# EasyEDA Pro project ProPrj_遥控_2025-12-06.epro, schematic NRF无线模块
Board Name: NRF无线模块; Create Date: 2025-10-11; Page Name: Sheet_1 copy; Project Name: 遥控; Schematic Name: NRF无线模块; Update Date: 2025-10-11; Add into BOM: yes; Company: Your Company; Convert to PCB: yes; Date: 2024-07-08; Draw By: akatople; REV: 1.0; Sheet: 1/1; spicePre: .
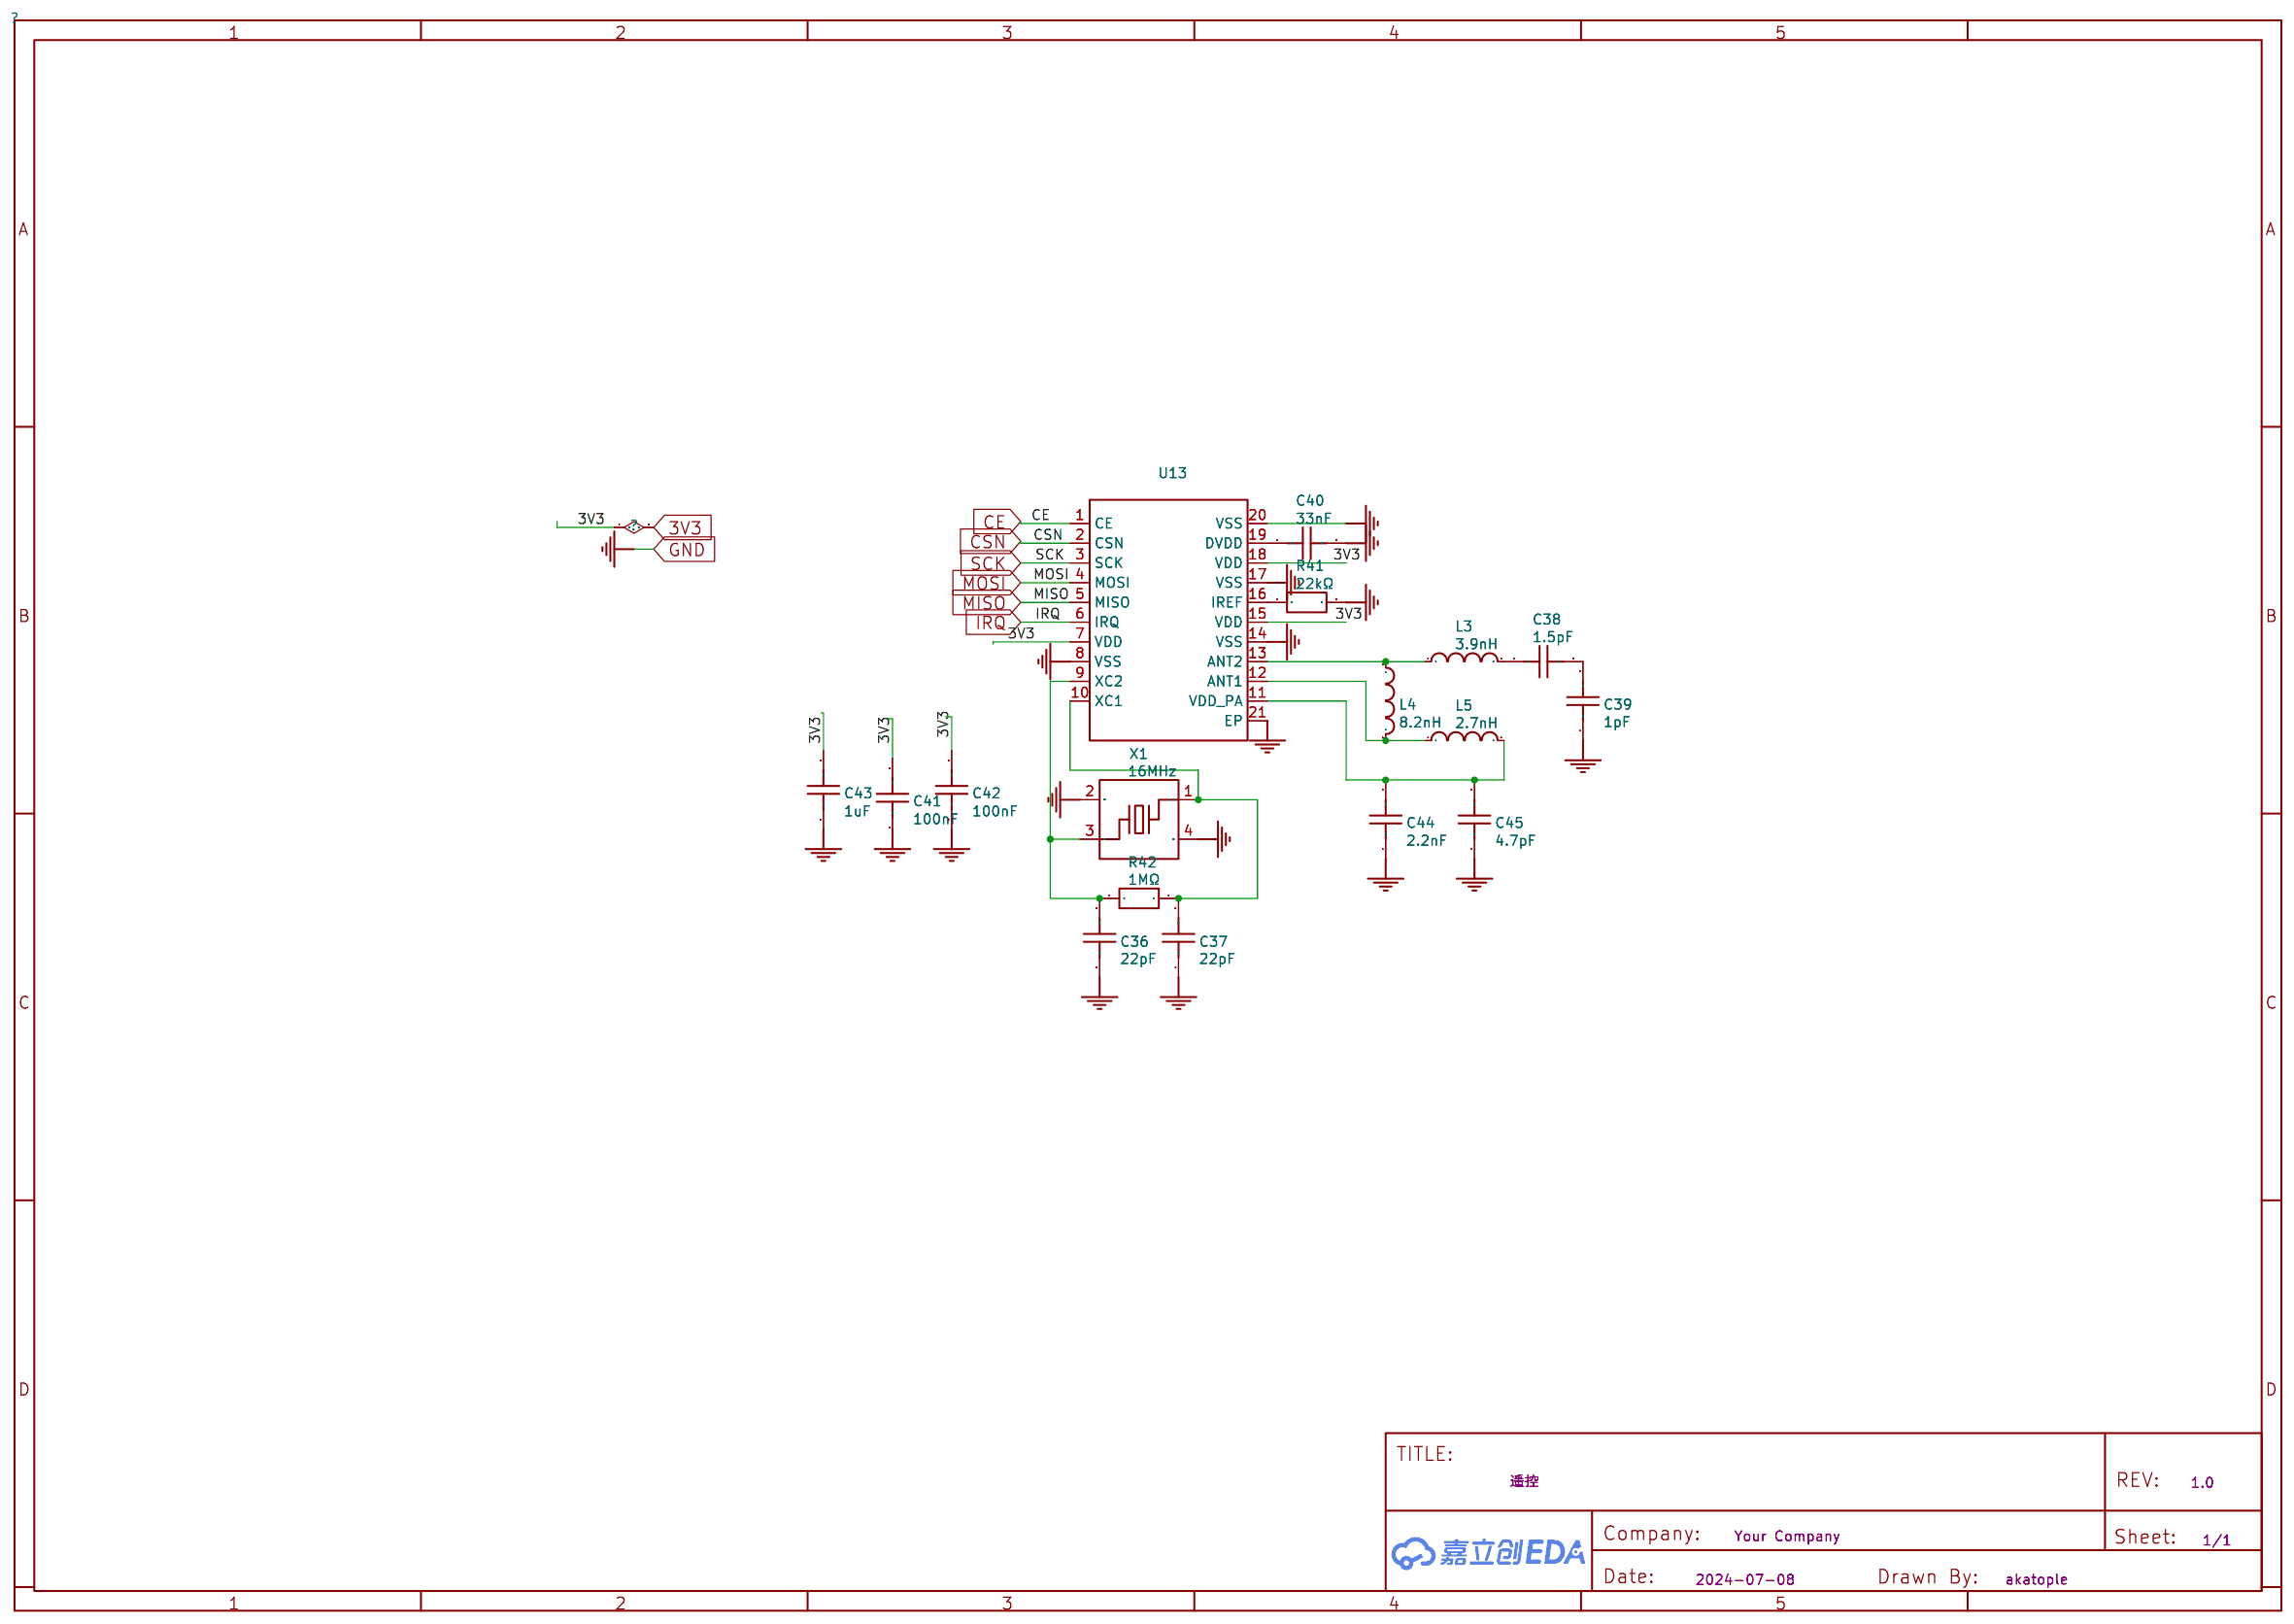
[diagram p3: schematic sheet]

## Parts
C36  22pF  [C0603]
C37  22pF  [C0603]
C38  1.5pF  [C0603]
C39  1pF  [C0603]
C40  33nF  [C0603]
C41  100nF  [C0603]
C42  100nF  [C0603]
C43  1uF  [C0603]
C44  2.2nF  [C0603]
C45  4.7pF  [C0603]
L3  3.9nH  [L0603]
L4  8.2nH  [L0603]
L5  2.7nH  [L0603]
R41  22kΩ  [R0603]
R42  1MΩ  [R0603]
U13  NRF24L01P-R  [QFN-20_L4.0-W4.0-P0.50-BL-EP]
X1  16MHz  [CRYSTAL-SMD_4P-L2.0-W1.6-BL]

## Library data of the parts
C36 C37 = CL10C220JB8NNNC: 容值:22pF;精度:±5%;额定电压:50V;温度系数:C0G;; LCSC Part Name: 22pF ±5% 50V; Supplier Part: C1653; Manufacturer: SAMSUNG(三星); Supplier Footprint: 0603; JLCPCB Part Class: Basic Part; Datasheet: https://item.szlcsc.com/datasheet/CL10C220JB8NNNC/2005.html; Supplier: LCSC; Tolerance: ±5%; Voltage Rating: 50V; Temperature Coefficient: C0G
C38 = 0603CG1R5C500NT: 容值:1.5pF;额定电压:50V;温度系数:C0G;; LCSC Part Name: ±0.25pF 1.5pF 50V; Supplier Part: C1639; Manufacturer: FH(风华); Supplier Footprint: 0603; JLCPCB Part Class: Extended Part; Datasheet: https://atta.szlcsc.com/upload/public/pdf/source/20200305/C486355_26A10D38EF8C2A5C37091D0039909270.pdf; Supplier: LCSC; Voltage Rating: 50V; Temperature Coefficient: C0G
C39 = 0603CG1R0C500NT: 容值:1pF;额定电压:50V;材质(温度系数):C0G;; LCSC Part Name: 1pF 50V; Supplier Part: C37117; Manufacturer: FH(风华); Supplier Footprint: 0603; JLCPCB Part Class: Extended Part; Datasheet: https://atta.szlcsc.com/upload/public/pdf/source/20200305/C486355_26A10D38EF8C2A5C37091D0039909270.pdf; Supplier: LCSC; Voltage Rated: 50V; Temperature Coefficient: C0G
C40 = CL10B333KB8NNNC: 容值:33nF;精度:±10%;额定电压:50V;温度系数:X7R;; LCSC Part Name: 33nF ±10% 50V; Supplier Part: C21117; Manufacturer: SAMSUNG(三星); Supplier Footprint: 0603; JLCPCB Part Class: Basic Part; Datasheet: https://item.szlcsc.com/datasheet/CL10B333KB8NNNC/21829.html; Supplier: LCSC; Tolerance: ±10%; Voltage Rating: 50V; Temperature Coefficient: X7R
C41 C42 = CC0603KRX7R9BB104: 容值:100nF;精度:±10%;额定电压:50V;温度系数:X7R;; LCSC Part Name: 100nF ±10% 50V; Supplier Part: C14663; Manufacturer: YAGEO(国巨); Supplier Footprint: 0603; JLCPCB Part Class: Basic Part; Datasheet: https://atta.szlcsc.com/upload/public/pdf/source/20250214/096C4C206003071F5D32E5F0D8E7F8DF.pdf; Supplier: LCSC; Tolerance: ±10%; Voltage Rating: 50V; Temperature Coefficient: X7R
C43 = CL10A105KB8NNNC: 容值:1uF;精度:±10%;额定电压:50V;温度系数:X5R;; LCSC Part Name: 1uF ±10% 50V; Supplier Part: C15849; Manufacturer: SAMSUNG(三星); Supplier Footprint: 0603; JLCPCB Part Class: Basic Part; Datasheet: https://item.szlcsc.com/datasheet/CL10A105KB8NNNC/16531.html; Supplier: LCSC; Tolerance: ±10%; Voltage Rating: 50V; Temperature Coefficient: X5R
C44 = 0603B222K500NT: 容值:2.2nF;精度:±10%;额定电压:50V;温度系数:X7R;; LCSC Part Name: 2.2nF ±10% 50V; Supplier Part: C1604; Manufacturer: FH(风华); Supplier Footprint: 0603; JLCPCB Part Class: Basic Part; Datasheet: https://atta.szlcsc.com/upload/public/pdf/source/20200305/C486355_26A10D38EF8C2A5C37091D0039909270.pdf; Supplier: LCSC; Tolerance: ±10%; Voltage Rating: 50V; Temperature Coefficient: X7R
C45 = 0603CG4R7C500NT: 容值:4.7pF;额定电压:50V;材质(温度系数):C0G;; LCSC Part Name: 4.7pF 50V; Supplier Part: C1669; Manufacturer: FH(风华); Supplier Footprint: 0603; JLCPCB Part Class: Extended Part; Datasheet: https://atta.szlcsc.com/upload/public/pdf/source/20200305/C486355_26A10D38EF8C2A5C37091D0039909270.pdf; Supplier: LCSC; Voltage Rated: 50V; Temperature Coefficient: C0G
L3 = SCC1608C3N9SSP: 电感值:3.9nH;额定电流:500mA;饱和电流(Isat):-;直流电阻(DCR):200mΩ;; Supplier Part: C412029; Manufacturer: Sunltech(顺磁); Supplier Footprint: 0603; JLCPCB Part Class: Extended Part; Datasheet: https://atta.szlcsc.com/upload/public/pdf/source/20190819/C412052_7E47CA9107AD18C13168C896A90007C8.pdf; Supplier: LCSC; Current Rating: 500mA; DC Resistance(DCR): 200mΩ
L4 = LQG18HN8N2J00D: 电感值:8.2nH;精度:±5%;额定电流:800mA;饱和电流(Isat):-;直流电阻(DCR):200mΩ;; LCSC Part Name: 8.2nH ±5%; Supplier Part: C98009; Manufacturer: muRata(村田); Supplier Footprint: 0603; JLCPCB Part Class: Extended Part; Datasheet: https://atta.szlcsc.com/upload/public/pdf/source/20180326/C98009_7046A2592ACD2B033EC7793A778D5AE4.pdf; Supplier: LCSC; Tolerance: ±5%; Rated Current: 800mA; DC Resistance (DCR): 200mΩ; Q @ Freq: 12@100MHz; Frequency - Self Resonant: 4GHz
L5 = VHF160808H2N7ST: 电感值:2.7nH;额定电流:400mA;饱和电流(Isat):-;直流电阻(DCR):200mΩ;; LCSC Part Name: ±0.3nH 2.7nH; Supplier Part: C83929; Manufacturer: FH(风华); Supplier Footprint: 0603; JLCPCB Part Class: Extended Part; Datasheet: https://atta.szlcsc.com/upload/public/pdf/source/20230223/8EF545BE87E825DABED9AF3380ABCE94.pdf; Supplier: LCSC; Current Rating: 400mA; DC Resistance(DCR): 200mΩ
R41 = 0603WAF2202T5E: 电阻类型:厚膜电阻;阻值:22kΩ;精度:±1%;功率:100mW;最大工作电压:75V;温度系数:±100ppm/℃;; LCSC Part Name: 22kΩ ±1% 100mW 厚膜电阻; Supplier Part: C31850; Manufacturer: UNI-ROYAL(厚声); Supplier Footprint: 0603; JLCPCB Part Class: Basic Part; Datasheet: https://atta.szlcsc.com/upload/public/pdf/source/20200306/C422600_1E6D84923E4A46A82E41ADD87F860B5C.pdf; Supplier: LCSC; Type: 厚膜电阻; Tolerance: ±1%; Power(Watts): 100mW; Overload Voltage (Max): 75V; Temperature Coefficient: ±100ppm/℃; Operating Temperature Range: -55℃~+155℃
R42 = 0603WAF1004T5E: 电阻类型:厚膜电阻;阻值:1MΩ;精度:±1%;功率:100mW;最大工作电压:75V;温度系数:±100ppm/℃;; LCSC Part Name: 1MΩ ±1% 100mW 厚膜电阻; Supplier Part: C22935; Manufacturer: UNI-ROYAL(厚声); Supplier Footprint: 0603; JLCPCB Part Class: Basic Part; Datasheet: https://atta.szlcsc.com/upload/public/pdf/source/20200306/C422600_1E6D84923E4A46A82E41ADD87F860B5C.pdf; Supplier: LCSC; Type: 厚膜电阻; Tolerance: ±1%; Power(Watts): 100mW; Overload Voltage (Max): 75V; Temperature Coefficient: ±100ppm/℃; Operating Temperature Range: -55℃~+155℃
U13 = NRF24L01P-R: 频率范围:2.4GHz~2.525GHz;接口类型:SPI;应用领域:-;数据速率:2Mbps;灵敏度:-82dBm;典型应用频率:2.4GHz;; LCSC Part Name: 单芯片2.4GHz收发器; Supplier Part: C8791; Manufacturer: NORDIC; Supplier Footprint: QFN-20-EP(4x4); JLCPCB Part Class: Extended Part; Datasheet: https://atta.szlcsc.com/upload/public/pdf/source/20120816/1457706530106.pdf; Supplier: LCSC; Frequency Range: 2.4GHz~2.525GHz; Interface: SPI; Voltage - Supply: 1.9V~3.6V; Output Power: 0dBm; Data Rate: 2Mbps; Current Of Transmitting: 11.3mA; Sensitivity: -82dBm; Receive Current: 13.5mA; Typical Application Frequency: 2.4GHz; Operating Temperature: -40℃~+85℃
X1 = 16MHz: Supplier: LCSC; Supplier Part: C2965579; Manufacturer: YXC(扬兴晶振); Manufacturer Part: XL7EL89COI-111YLC-16M; JLCPCB Part Class: Extended Part; nameAlias: Value; Contributor: lcsc; spicePre: X; spiceSymbolName: XL7EL89COI-111YLC-16M

## Nets
3V3: C41.2 C42.2 C43.2 U13.7(VDD) U13.15(VDD) U13.18(VDD)
GND: C36.1 C37.1 C39.1 C40.2 C41.1 C42.1 C43.1 C44.1 C45.1 R41.2 U13.8(VSS) U13.14(VSS) U13.17(VSS) U13.20(VSS) U13.21(EP) X1.2(GND) X1.4(GND)
CE: U13.1(CE)
CSN: U13.2(CSN)
IRQ: U13.6(IRQ)
MISO: U13.5(MISO)
MOSI: U13.4(MOSI)
SCK: U13.3(SCK)
$1N3893: L3.1 L4.1 U13.13(ANT2)
$1N3894: L4.2 L5.1 U13.12(ANT1)
$1N3895: C44.2 C45.2 L5.2 U13.11(VDD_PA)
$1N3896: C36.2 R42.2 U13.9(XC2) X1.3
$1N3897: C37.2 R42.1 U13.10(XC1) X1.1
$1N3900: R41.1 U13.16(IREF)
$1N3902: C40.1 U13.19(DVDD)
$1N3906: C38.1 L3.2
$1N3907: C38.2 C39.2
